# Altium schematic sheet Main.SchDoc
size A3
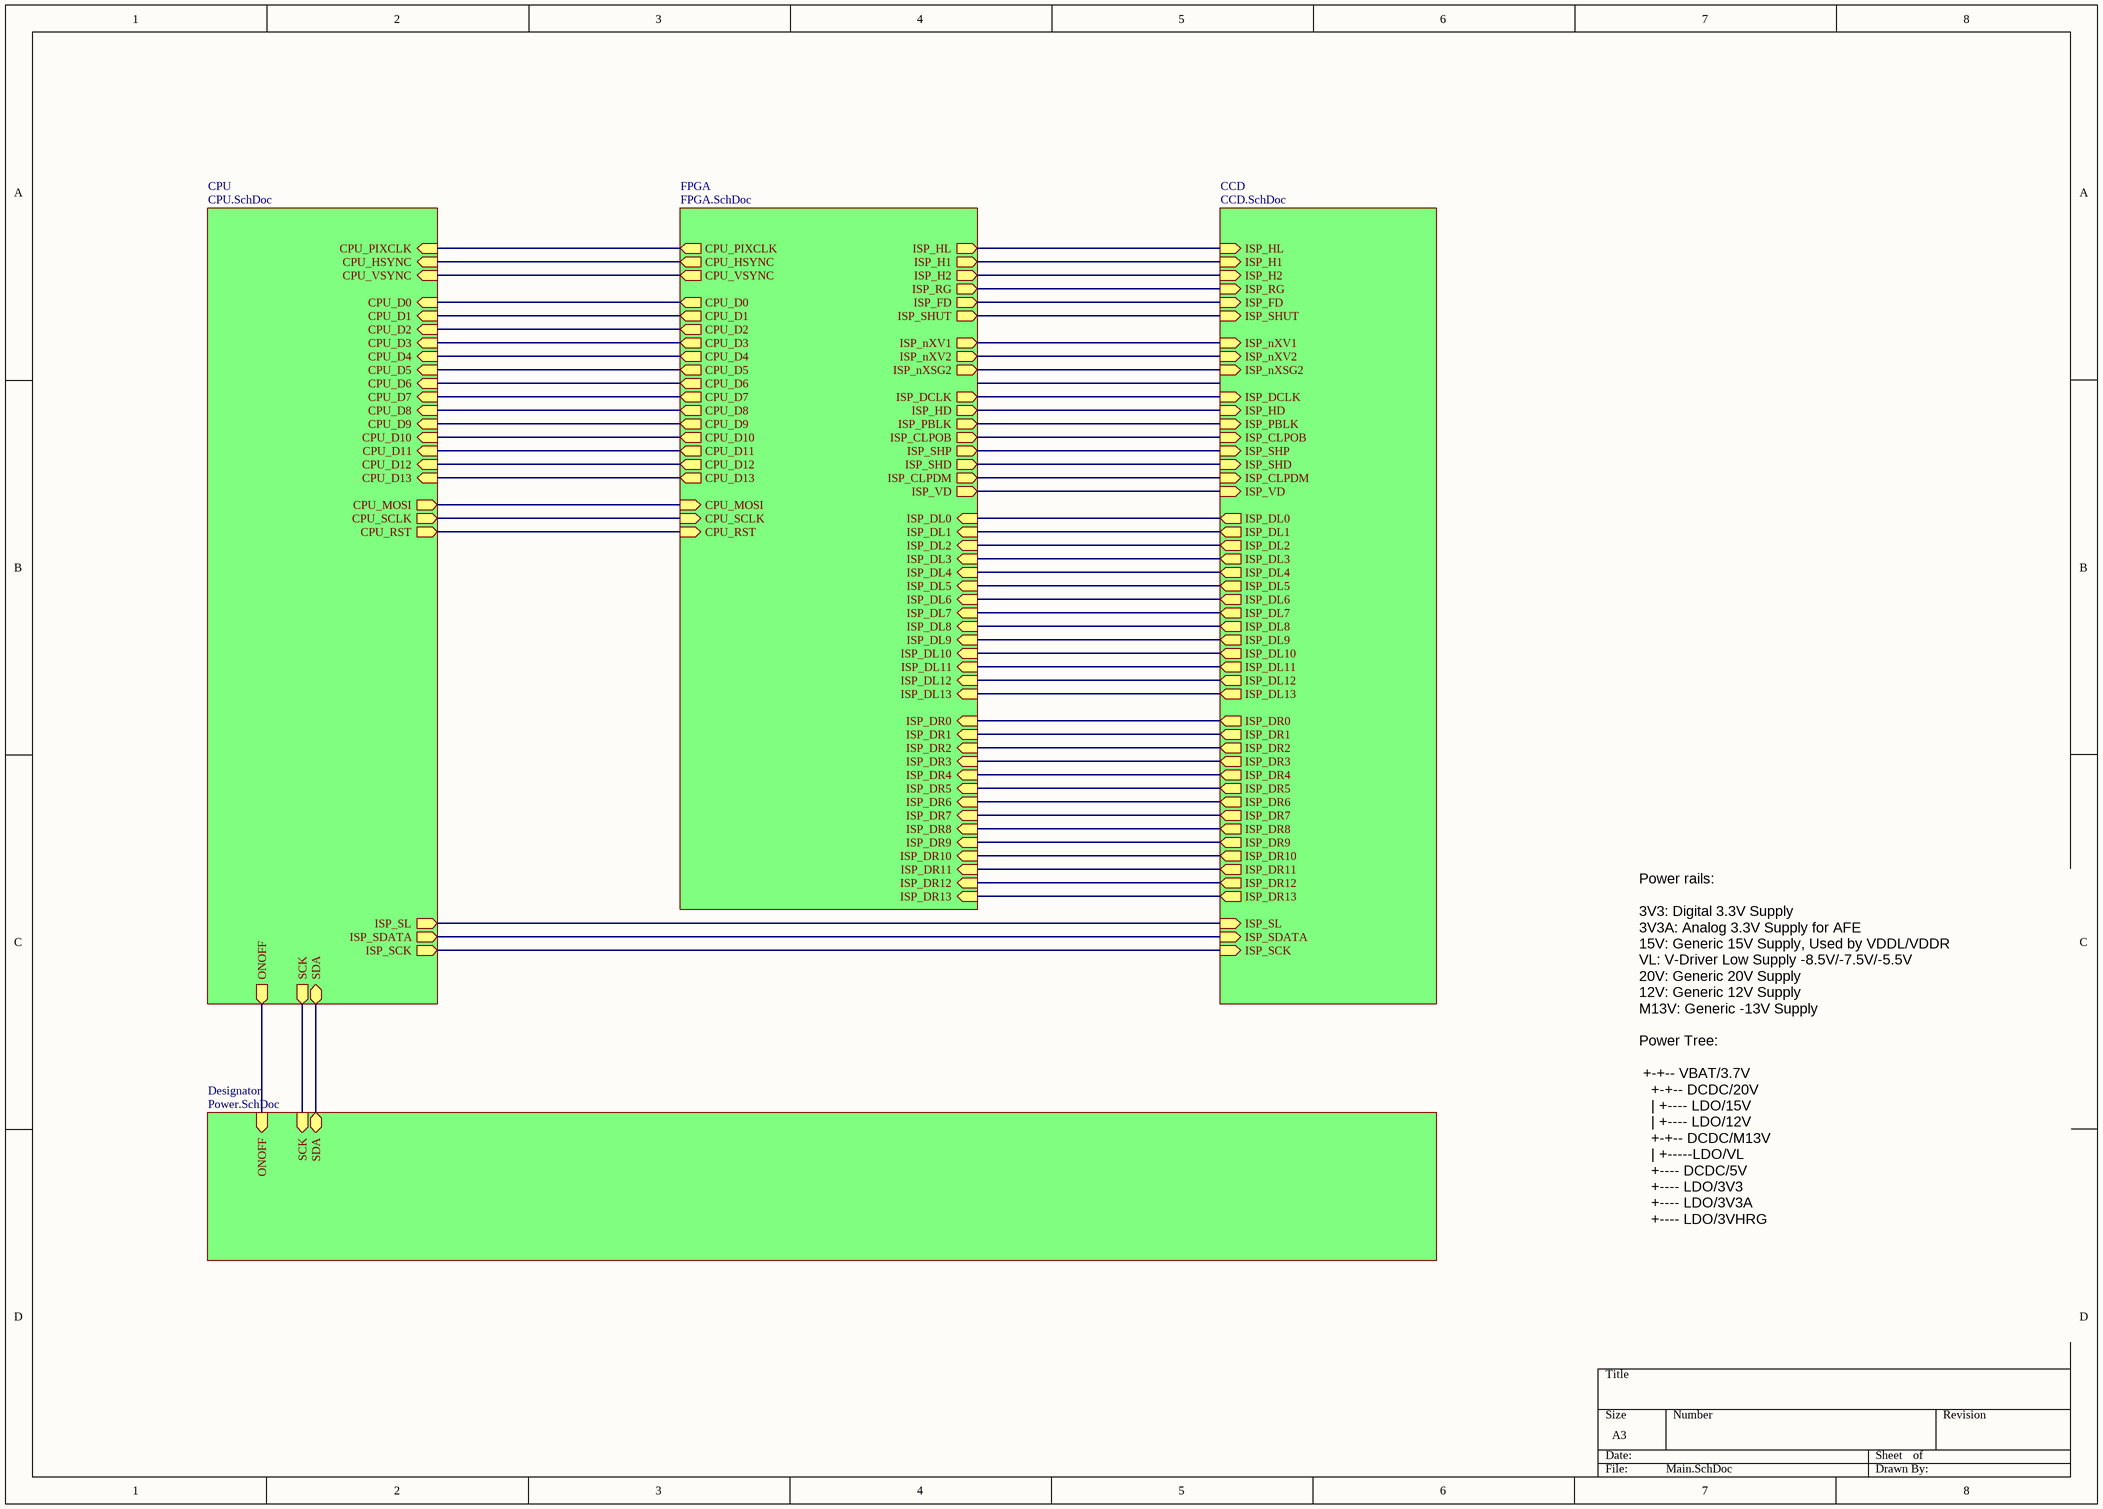
[diagram p0: Main.SchDoc]

## Sub-sheets
CCD = CCD.SchDoc: ISP_HL (in), ISP_H1 (in), ISP_H2 (in), ISP_RG (in), ISP_FD (in), ISP_SHUT (in), ISP_nXV1 (in), ISP_nXV2 (in), ISP_nXSG2 (in), ISP_DCLK (in), ISP_HD (in), ISP_PBLK (in), ISP_CLPOB (in), ISP_SHP (in), ISP_SHD (in), ISP_CLPDM (in), ISP_VD (in), ISP_SL (in), ISP_SDATA (in), ISP_SCK (in), ISP_DL0 (out), ISP_DL1 (out), ISP_DL2 (out), ISP_DL3 (out), ISP_DL4 (out), ISP_DL5 (out), ISP_DL6 (out), ISP_DL7 (out), ISP_DL8 (out), ISP_DL9 (out), ISP_DL10 (out), ISP_DL11 (out), ISP_DL12 (out), ISP_DL13 (out), ISP_DR0 (out), ISP_DR1 (out), ISP_DR2 (out), ISP_DR3 (out), ISP_DR4 (out), ISP_DR5 (out), ISP_DR6 (out), ISP_DR7 (out), ISP_DR8 (out), ISP_DR9 (out), ISP_DR10 (out), ISP_DR11 (out), ISP_DR12 (out), ISP_DR13 (out)
CPU = CPU.SchDoc: CPU_PIXCLK (in), CPU_HSYNC (in), CPU_VSYNC (in), CPU_D0 (in), CPU_D1 (in), CPU_D2 (in), CPU_D3 (in), CPU_D4 (in), CPU_D5 (in), CPU_D6 (in), CPU_D7 (in), CPU_D8 (in), CPU_D9 (in), CPU_D10 (in), CPU_D11 (in), CPU_D12 (in), CPU_D13 (in), CPU_MOSI (out), CPU_SCLK (out), CPU_RST (out), ISP_SL (out), ISP_SDATA (out), ISP_SCK (out), ONOFF (out), SCK (out), SDA (bidir)
Designator = Power.SchDoc: ONOFF (in), SCK (in), SDA (bidir)
FPGA = FPGA.SchDoc: ISP_HL (out), ISP_H1 (out), ISP_H2 (out), ISP_RG (out), ISP_FD (out), ISP_SHUT (out), ISP_nXV1 (out), ISP_nXV2 (out), ISP_nXSG2 (out), ISP_DCLK (out), ISP_HD (out), ISP_PBLK (out), ISP_CLPOB (out), ISP_SHP (out), ISP_SHD (out), ISP_CLPDM (out), ISP_VD (out), ISP_DL0 (in), ISP_DL1 (in), ISP_DL2 (in), ISP_DL3 (in), ISP_DL4 (in), ISP_DL5 (in), ISP_DL6 (in), ISP_DL7 (in), ISP_DL8 (in), ISP_DL9 (in), ISP_DL10 (in), ISP_DL11 (in), ISP_DL12 (in), ISP_DL13 (in), ISP_DR0 (in), ISP_DR1 (in), ISP_DR2 (in), ISP_DR3 (in), ISP_DR4 (in), ISP_DR5 (in), ISP_DR6 (in), ISP_DR7 (in), ISP_DR8 (in), ISP_DR9 (in), ISP_DR10 (in), ISP_DR11 (in), ISP_DR12 (in), ISP_DR13 (in), CPU_PIXCLK (out), CPU_HSYNC (out), CPU_VSYNC (out), CPU_D0 (out), CPU_D1 (out), CPU_D2 (out), CPU_D3 (out), CPU_D4 (out), CPU_D5 (out), CPU_D6 (out), CPU_D7 (out), CPU_D8 (out), CPU_D9 (out), CPU_D10 (out), CPU_D11 (out), CPU_D12 (out), CPU_D13 (out), CPU_MOSI (in), CPU_SCLK (in), CPU_RST (in)

## Nets
(unnamed): sheet CCD/ISP_HL, sheet FPGA/ISP_HL
(unnamed): sheet CCD/ISP_H1, sheet FPGA/ISP_H1
(unnamed): sheet CCD/ISP_H2, sheet FPGA/ISP_H2
(unnamed): sheet CCD/ISP_RG, sheet FPGA/ISP_RG
(unnamed): sheet CCD/ISP_FD, sheet FPGA/ISP_FD
(unnamed): sheet CCD/ISP_SHUT, sheet FPGA/ISP_SHUT
(unnamed): sheet CCD/ISP_nXV1, sheet FPGA/ISP_nXV1
(unnamed): sheet CCD/ISP_nXV2, sheet FPGA/ISP_nXV2
(unnamed): sheet CCD/ISP_nXSG2, sheet FPGA/ISP_nXSG2
(unnamed): sheet CCD/ISP_DCLK, sheet FPGA/ISP_DCLK
(unnamed): sheet CCD/ISP_HD, sheet FPGA/ISP_HD
(unnamed): sheet CCD/ISP_PBLK, sheet FPGA/ISP_PBLK
(unnamed): sheet CCD/ISP_CLPOB, sheet FPGA/ISP_CLPOB
(unnamed): sheet CCD/ISP_SHP, sheet FPGA/ISP_SHP
(unnamed): sheet CCD/ISP_SHD, sheet FPGA/ISP_SHD
(unnamed): sheet CCD/ISP_CLPDM, sheet FPGA/ISP_CLPDM
(unnamed): sheet CCD/ISP_VD, sheet FPGA/ISP_VD
(unnamed): sheet CCD/ISP_SL, sheet CPU/ISP_SL
(unnamed): sheet CCD/ISP_SDATA, sheet CPU/ISP_SDATA
(unnamed): sheet CCD/ISP_SCK, sheet CPU/ISP_SCK
(unnamed): sheet CCD/ISP_DL0, sheet FPGA/ISP_DL0
(unnamed): sheet CCD/ISP_DL1, sheet FPGA/ISP_DL1
(unnamed): sheet CCD/ISP_DL2, sheet FPGA/ISP_DL2
(unnamed): sheet CCD/ISP_DL3, sheet FPGA/ISP_DL3
(unnamed): sheet CCD/ISP_DL4, sheet FPGA/ISP_DL4
(unnamed): sheet CCD/ISP_DL5, sheet FPGA/ISP_DL5
(unnamed): sheet CCD/ISP_DL6, sheet FPGA/ISP_DL6
(unnamed): sheet CCD/ISP_DL7, sheet FPGA/ISP_DL7
(unnamed): sheet CCD/ISP_DL8, sheet FPGA/ISP_DL8
(unnamed): sheet CCD/ISP_DL9, sheet FPGA/ISP_DL9
(unnamed): sheet CCD/ISP_DL10, sheet FPGA/ISP_DL10
(unnamed): sheet CCD/ISP_DL11, sheet FPGA/ISP_DL11
(unnamed): sheet CCD/ISP_DL12, sheet FPGA/ISP_DL12
(unnamed): sheet CCD/ISP_DL13, sheet FPGA/ISP_DL13
(unnamed): sheet CCD/ISP_DR0, sheet FPGA/ISP_DR0
(unnamed): sheet CCD/ISP_DR1, sheet FPGA/ISP_DR1
(unnamed): sheet CCD/ISP_DR2, sheet FPGA/ISP_DR2
(unnamed): sheet CCD/ISP_DR3, sheet FPGA/ISP_DR3
(unnamed): sheet CCD/ISP_DR4, sheet FPGA/ISP_DR4
(unnamed): sheet CCD/ISP_DR5, sheet FPGA/ISP_DR5
(unnamed): sheet CCD/ISP_DR6, sheet FPGA/ISP_DR6
(unnamed): sheet CCD/ISP_DR7, sheet FPGA/ISP_DR7
(unnamed): sheet CCD/ISP_DR8, sheet FPGA/ISP_DR8
(unnamed): sheet CCD/ISP_DR9, sheet FPGA/ISP_DR9
(unnamed): sheet CCD/ISP_DR10, sheet FPGA/ISP_DR10
(unnamed): sheet CCD/ISP_DR11, sheet FPGA/ISP_DR11
(unnamed): sheet CCD/ISP_DR12, sheet FPGA/ISP_DR12
(unnamed): sheet CCD/ISP_DR13, sheet FPGA/ISP_DR13
(unnamed): sheet FPGA/CPU_PIXCLK, sheet CPU/CPU_PIXCLK
(unnamed): sheet FPGA/CPU_HSYNC, sheet CPU/CPU_HSYNC
(unnamed): sheet FPGA/CPU_VSYNC, sheet CPU/CPU_VSYNC
(unnamed): sheet FPGA/CPU_D0, sheet CPU/CPU_D0
(unnamed): sheet FPGA/CPU_D1, sheet CPU/CPU_D1
(unnamed): sheet FPGA/CPU_D2, sheet CPU/CPU_D2
(unnamed): sheet FPGA/CPU_D3, sheet CPU/CPU_D3
(unnamed): sheet FPGA/CPU_D4, sheet CPU/CPU_D4
(unnamed): sheet FPGA/CPU_D5, sheet CPU/CPU_D5
(unnamed): sheet FPGA/CPU_D6, sheet CPU/CPU_D6
(unnamed): sheet FPGA/CPU_D7, sheet CPU/CPU_D7
(unnamed): sheet FPGA/CPU_D8, sheet CPU/CPU_D8
(unnamed): sheet FPGA/CPU_D9, sheet CPU/CPU_D9
(unnamed): sheet FPGA/CPU_D10, sheet CPU/CPU_D10
(unnamed): sheet FPGA/CPU_D11, sheet CPU/CPU_D11
(unnamed): sheet FPGA/CPU_D12, sheet CPU/CPU_D12
(unnamed): sheet FPGA/CPU_D13, sheet CPU/CPU_D13
(unnamed): sheet FPGA/CPU_MOSI, sheet CPU/CPU_MOSI
(unnamed): sheet FPGA/CPU_SCLK, sheet CPU/CPU_SCLK
(unnamed): sheet FPGA/CPU_RST, sheet CPU/CPU_RST
(unnamed): sheet CPU/ONOFF, sheet Designator/ONOFF
(unnamed): sheet CPU/SCK, sheet Designator/SCK
(unnamed): sheet CPU/SDA, sheet Designator/SDA

## Notes on the sheet
- Power rails:
  3V3: Digital 3.3V Supply
  3V3A: Analog 3.3V Supply for AFE
  15V: Generic 15V Supply, Used by VDDL/VDDR
  VL: V-Driver Low Supply -8.5V/-7.5V/-5.5V
  20V: Generic 20V Supply
  12V: Generic 12V Supply
  M13V: Generic -13V Supply
  Power Tree:
  +-+-- VBAT/3.7V
  +-+-- DCDC/20V
  | +---- LDO/15V
  | +---- LDO/12V
  +-+-- DCDC/M13V
  | +-----LDO/VL
  +---- DCDC/5V
  +---- LDO/3V3
  +---- LDO/3V3A
  +---- LDO/3VHRG